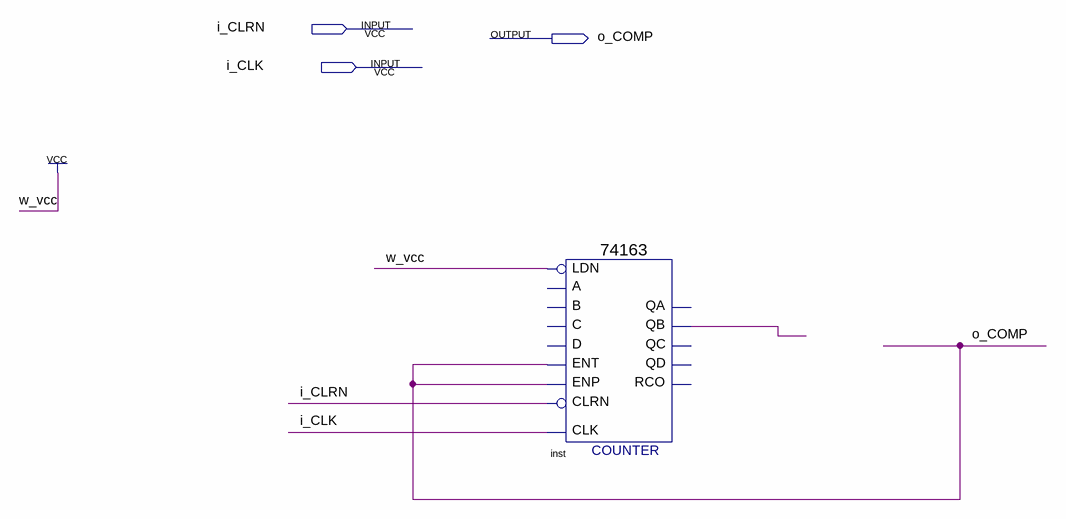
[diagram p0: schematic sheet]
// Quartus schematic counter_4.bdf as structural Verilog: 1 symbols, 3 pins
module counter_4 (
  input  i_CLRN,
  input  i_CLK,
  output o_COMP
);

  wire inst_qb;

  \74163  inst (
    .ENT(o_COMP), .CLRN(i_CLRN), .CLK(i_CLK), .ENP(o_COMP), .LDN(1'b1), .QB(inst_qb));  // open: C, B, A, D, QA, QC, QD, RCO
endmodule
